# EAGLE design motor_side (EAGLE 9.6.0)
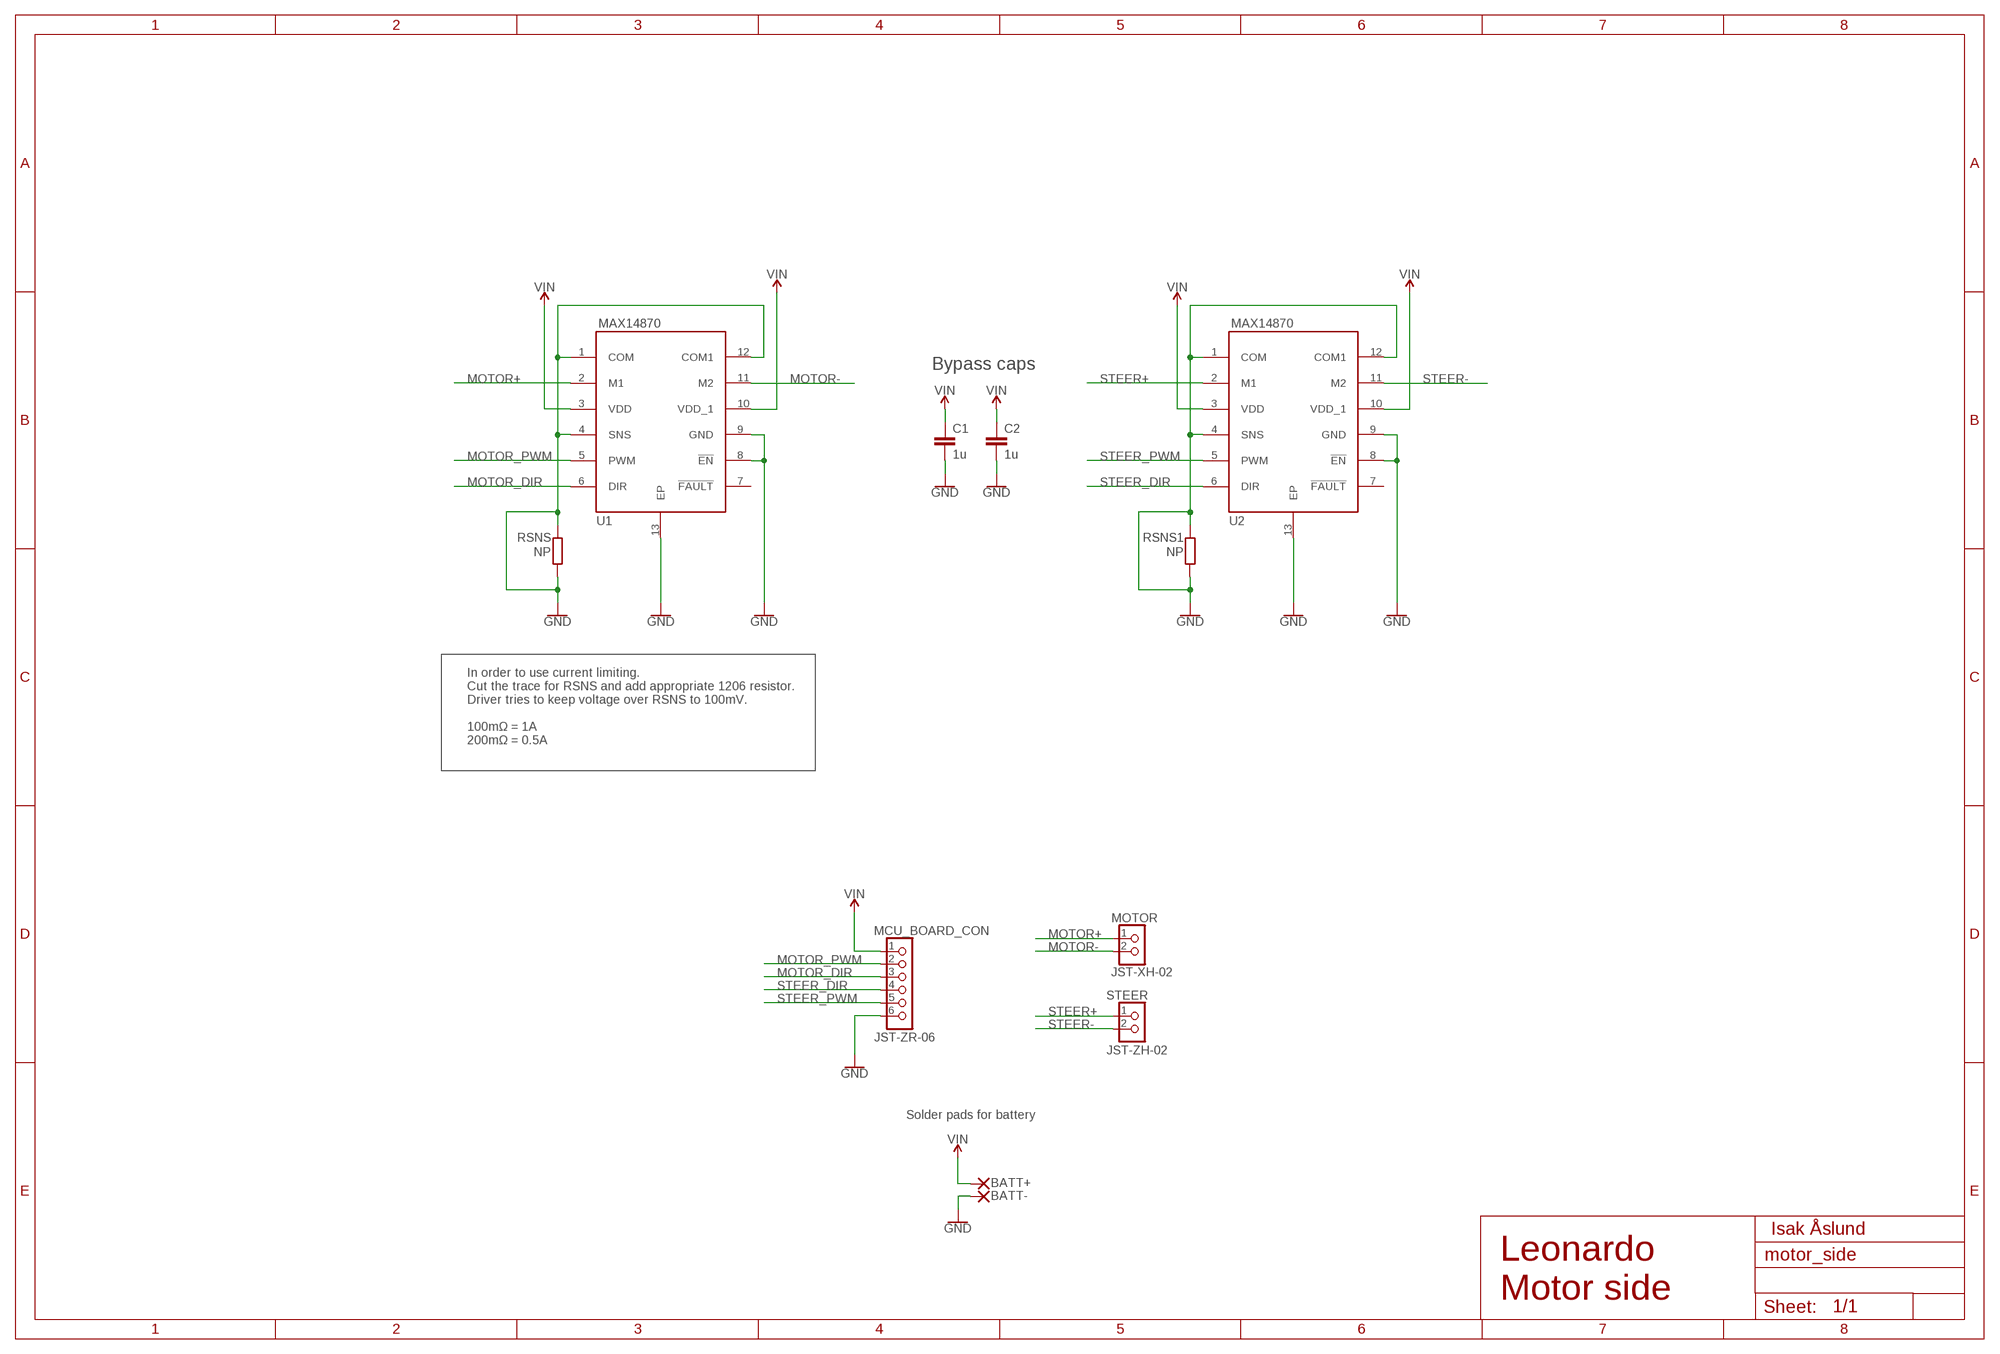
[diagram p0: schematic, sheet 1]

## Parts
BATT+  SMD2  [SMD1,27-2,54]
BATT-  SMD2  [SMD1,27-2,54]
C1  1u  C0603  [C0603]
C2  1u  C0603  [C0603]
MCU_BOARD_CON  JST-ZR-06  ZR_B6B-ZR  [B6B-ZR]
MOTOR  JST-XH-02  XH-02  [JST-XH-02]
RSNS  NP  R1206  [R1206]
RSNS1  NP  R1206  [R1206]
STEER  JST-ZH-02  ZR_B2B-ZR  [B2B-ZR]
U1  MAX14870  [12_TDFN_EP]
U2  MAX14870  [12_TDFN_EP]

## Nets
GND: BATT-.1(P) C1.2 C2.2 MCU_BOARD_CON.6 RSNS1.1 RSNS1.2 RSNS.1 RSNS.2 U1.1(COM) U1.4(SNS) U1.8(!EN) U1.9(GND) U1.12(COM1) U1.13(EP) U2.1(COM) U2.4(SNS) U2.8(!EN) U2.9(GND) U2.12(COM1) U2.13(EP)
MOTOR+: MOTOR.1 U1.2(M1)
MOTOR-: MOTOR.2 U1.11(M2)
MOTOR_DIR: MCU_BOARD_CON.3 U1.6(DIR)
MOTOR_PWM: MCU_BOARD_CON.2 U1.5(PWM)
STEER+: STEER.1 U2.2(M1)
STEER-: STEER.2 U2.11(M2)
STEER_DIR: MCU_BOARD_CON.4 U2.6(DIR)
STEER_PWM: MCU_BOARD_CON.5 U2.5(PWM)
VIN: BATT+.1(P) C1.1 C2.1 MCU_BOARD_CON.1 U1.3(VDD) U1.10(VDD_1) U2.3(VDD) U2.10(VDD_1)
Unconnected: U1.7(!FAULT) U2.7(!FAULT)

## Notes on the sheet
- Bypass caps
- In order to use current limiting. 
  Cut the trace for RSNS and add appropriate 1206 resistor.
  Driver tries to keep voltage over RSNS to 100mV.
  
  100mΩ = 1A
  200mΩ = 0.5A
- Solder pads for battery
- Isak Åslund
- Leonardo
  Motor side

## Library data of the parts
BATT+ BATT- = wirepad:SMD2: SMD PAD
C1 C2 = CASE-RCL:C0603: Standard Chip CAPACITOR 0605 (1608 Metric) Description: Standard Chip CAPACITOR 0605 (1608 Metric)
MCU_BOARD_CON = CASE-JST:ZR_B6B-ZR: JST ZR Connector, through hole, 6 pin, top entry Description: JST ZR connector with 1.5 mm pitch, through hole version, 6 pin, top entry. Links: Datasheet <http://www.jst-mfg.com/product/pdf/eng/eZH.pdf>
MOTOR = CASE-JST:XH-02: JST EX Connector, through hole, 2 pin, top entry Description: JST XH connector with 2.54 mm pitch, through hole version, 2 pin, top entry. Links: Datasheet <=>
RSNS RSNS1 = CASE-RCL:R1206: Standard Chip RESISTOR 1206 (3216 Metric) Description: Standard Chip RESISTOR 1206 (3216 Metric)
STEER = CASE-JST:ZR_B2B-ZR: JST ZR Connector, through hole, 2 pin, top entry Description: JST ZR connector with 1.5 mm pitch, through hole version, 2 pin, top entry. Links: Datasheet <http://www.jst-mfg.com/product/pdf/eng/eZH.pdf>
U1 U2 = Isaks Bibliotek:MAX14870

## Board
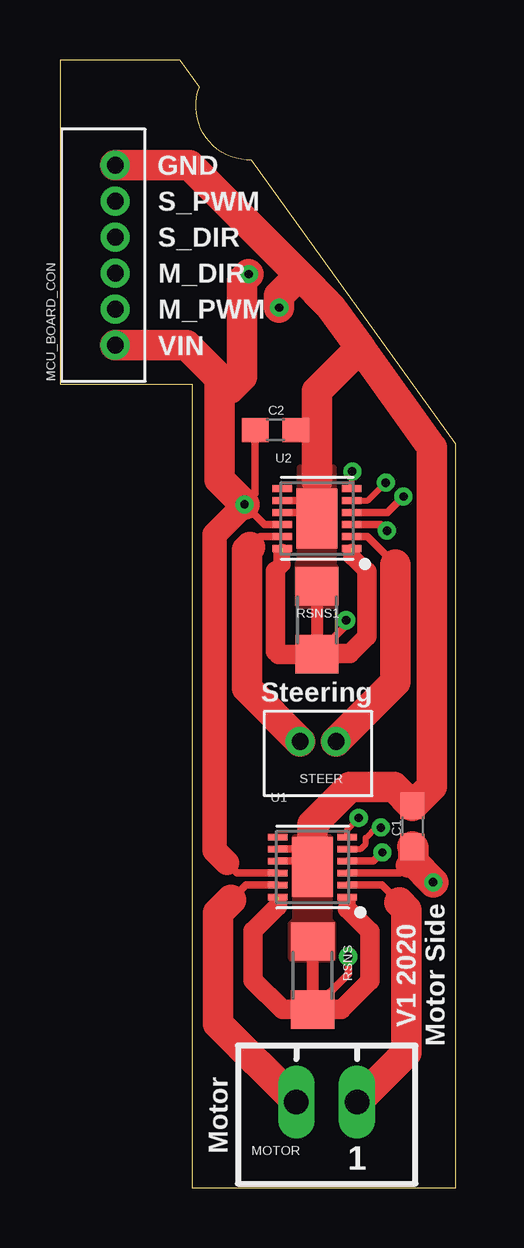
[diagram p1: board, top side]
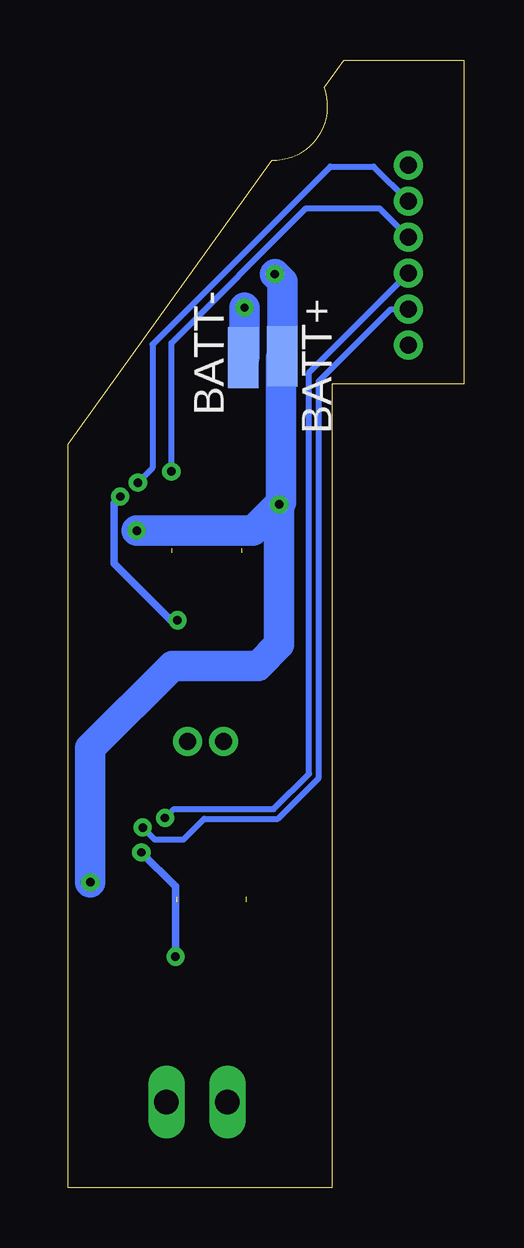
[diagram p2: board, bottom side, seen from below]

Size 16.5 x 47 mm. Coordinates in mm from the lower left corner, seen from the top.
Outline: 5,47 0,47 0,33.5 5.5,33.5 5.5,0 16.5,0 16.5,31 8,42.83 arc-113 5.82,45.86 5,47
Copper layers (1*16): Top 0.035mm / dielectric 1.5mm / Bottom 0.035mm
Design rules "default *": minimum track width 6mil, minimum drill 0.35mm, track to track 6mil, track to pad 6mil, pad to pad 6mil, via to via 6mil, smd to smd 6mil, copper to edge 10mil, drill to drill 6mil, minimum pad ring 10mil, minimum via ring 8mil, stop-mask expansion 4mil, vias tented up to drill 0mil, thermal gap 10mil

### Footprints (pad centres in the part's own frame; a part is rotated, then mirrored left to right if it is on the bottom)
SMD1,27-2,54 = smd 1.27 x 2.54: 1 0,0
C0603 = smd 1.1 x 1: 1 -0.85,0; 2 0.85,0
B6B-ZR = drill 0.7: 1 -3.75,0; 2 -2.25,0; 3 -0.75,0; 4 0.75,0; 5 2.25,0; 6 3.75,0
JST-XH-02 = drill 1.016 long: 1 -1.27,0; 2 1.27,0
R1206 = smd 1.6 x 1.803: 1 -1.422,0; 2 1.422,0
B2B-ZR = drill 0.7: 1 -0.75,0; 2 0.75,0
12_TDFN_EP = smd 0.812 x 0.282: 1 -1.45,1.25; 2 -1.45,0.75; 3 -1.45,0.25; 4 -1.45,-0.25; 5 -1.45,-0.75; 6 -1.45,-1.25; 7 1.45,-1.25; 8 1.45,-0.75; 9 1.45,-0.25; 10 1.45,0.25; 11 1.45,0.75; 12 1.45,1.25 | smd 1.7 x 2.5: 13 0,0

### Placement (x,y rotation side)
BATT+  7.57,34.65 180 bottom
BATT-  9.19,34.59 0 bottom
C1  14.71,15.06 90 top
C2  8.99,31.57 0 top
MCU_BOARD_CON  2.31,38.86 90 top
MOTOR  11.13,3.56 180 top
RSNS  10.54,8.84 270 top
RSNS1  10.72,23.65 270 top
STEER  10.77,18.59 180 top
U1  10.53,13.35 180 top
U2  10.72,27.89 180 top

### Tracks (layer width: path | path; a pad name or v marks a point on that pad's centre or on a via)
GND  (via drill 0.35)  (4 unrouted)
  Top 0.305: U1.8 10.53,14.11 10.53,14.1 | U1.9 10.28,13.61 U1.13 | U2.8 10.4,28.64 10.52,28.52 10.13,28.14 U2.9 | C2.2 10.72,30.7 10.72,29.41 U2.13 | RSNS.2 12.02,8.9 v12.02,9.63 | v13.45,13.97 13.08,13.61 U1.4 | RSNS1.2 11.94,23.45 v11.94,23.65 | v14.33,28.8 13.66,28.14 U2.4
  Top 0.508: RSNS.1 RSNS.2 | RSNS1.1 RSNS1.2
  Top 0.711: 9.08,11.72 9.08,11.9 | 11.98,11.61 11.98,11.9 | 8.99,25.7 9.27,25.98 9.27,26.48 | 12.8,25.67 12.17,26.3 12.17,26.48
  Top 0.813: 10.52,13.37 U1.13 | 9.08,11.72 8.05,10.69 8.05,8.64 9.27,7.42 RSNS.2 11.73,7.42 12.93,8.61 12.93,10.67 11.98,11.61 | 8.99,25.7 8.99,22.35 9.12,22.23 RSNS1.2 10.74,22.25 12.09,22.25 12.8,22.96 12.8,25.67
  Top 1.27: U1.13 10.53,14.1 10.53,15.13 12.1,16.7 13.92,16.7 C1.2 15.52,16.73 15.52,30.84 12.52,35.01 | 12.52,35.01 11.29,36.72 9.99,38.03 | 9.99,38.03 5.4,42.61 MCU_BOARD_CON.6 | 10.72,29.41 10.72,33.2 12.52,35.01 | v9.14,36.68 9.14,37.19 9.99,38.03
  Bottom 0.305: v12.02,9.63 12.02,12.55 v13.45,13.97 | v14.33,28.8 14.33,28.78 14.58,28.52 14.58,26.01 12.22,23.65 v11.94,23.65
  Bottom 1.27: 9.17,34.62 BATT-.1 9.14,34.65 v9.14,36.68
  pour Top (no thermals): 9.68,9.5 11.35,9.5 11.43,9.58 11.43,11 11.28,11.15 11.28,14.61 9.78,14.61 9.78,11.15 9.6,10.97 9.6,9.58
  pour Top (no thermals): 11.46,24.28 11.46,25.86 11.38,25.93 11.38,30 10.03,30 10.03,26.09 9.96,26.01 9.96,24.28
MOTOR+
  Top 0.305: U1.2 13.43,12.61 14.15,11.89
  Top 1.27: MOTOR.1 14.45,5.61 14.45,11.58 14.15,11.89
MOTOR-
  Top 0.305: U1.11 7.75,12.61 7.14,11.99
  Top 1.27: MOTOR.2 9.86,3.58 6.6,6.83 6.6,11.46 7.14,11.99
MOTOR_DIR  (via drill 0.35)
  Top 0.254: U1.6 11.98,14.93 v12.46,15.41
  Bottom 0.254: v12.46,15.41 12.09,15.77 7.92,15.77 6.45,17.25 6.45,33.97 MCU_BOARD_CON.3
MOTOR_PWM  (via drill 0.35)
  Top 0.254: U1.5 12.52,14.11 12.52,14.1 12.75,14.33 12.75,14.58 13.18,15.01 v13.39,15.01
  Bottom 0.254: v13.39,15.01 12.88,14.5 11.68,14.5 10.82,15.37 7.76,15.37 6.04,17.08 6.04,33.6 3.04,36.61 MCU_BOARD_CON.2
STEER+
  Top 0.305: U2.2 12.81,27.14 13.99,25.96
  Top 1.27: 13.99,25.96 13.99,21.07 STEER.1
STEER-
  Top 0.305: U2.11 8.37,27.14 7.92,26.7
  Top 1.27: 7.92,26.7 7.8,26.57 7.8,20.82 STEER.2
STEER_DIR  (via drill 0.35)
  Top 0.254: U2.6 12.17,29.82 v12.19,29.85
  Bottom 0.254: v12.19,29.85 12.19,35.2 6.58,40.82 3.52,40.82 MCU_BOARD_CON.4
STEER_PWM  (via drill 0.35)
  Top 0.254: U2.5 12.85,28.64 v13.59,29.38
  Bottom 0.254: v13.59,29.38 12.98,29.99 12.98,35.14 5.56,42.56 3.76,42.56 MCU_BOARD_CON.5
VIN  (via drill 0.35)
  Top 0.305: U1.3 14.17,13.11 14.5,13.44 | U1.10 7.39,13.11 6.96,13.54 | U2.10 8.53,27.64 v7.7,28.47 8.14,28.92 C2.1 | U2.3 13.38,27.64 v13.64,27.38
  Top 1.016: 14.5,13.44 14.71,13.64 C1.1 | 6.96,13.54 6.45,14.05 6.45,27.23 v7.7,28.47
  Top 1.27: v7.7,28.47 6.66,29.52 6.66,33.73 | 6.66,33.73 7.09,33.3 7.59,33.81 7.59,37.8 v7.87,38.08 | 6.66,33.73 5.27,35.11 MCU_BOARD_CON.1 | C1.1 14.73,14.19 14.73,13.56 v15.57,12.72
  Bottom 1.27: v13.64,27.38 8.79,27.38 v7.7,28.47 | 7.59,34.67 BATT+.1 | v15.57,12.72 15.57,18.31 12.14,21.74 8.59,21.74 7.7,22.63 v7.7,28.47 | BATT+.1 7.62,34.59 7.62,28.55 v7.7,28.47 | BATT+.1 7.57,34.72 7.57,35.64 7.57,37.77 v7.87,38.08

### Text on the board
tPlace: GND | S_PWM | S_DIR | M_DIR | M_PWM | VIN | Steering | V1 2020 / Motor Side | Motor